# Altium schematic sheet FMC_PINBREAKOUT.SchDoc: 2.54mm Pin Header (3x 42 pos), and SMA jacks (7x)
size A4; Date: 02-NOV-2020; DrawnBy: PFH; Engineer: PFH; Organization: IAM Electronic GmbH; Revision: A; SheetNumber: 2; SheetTotal: 2; Projekt: FMC LPC Pin Header Board; Website: www.iamelectronic.com; ImagePath: FMC LPC Pinheader Board
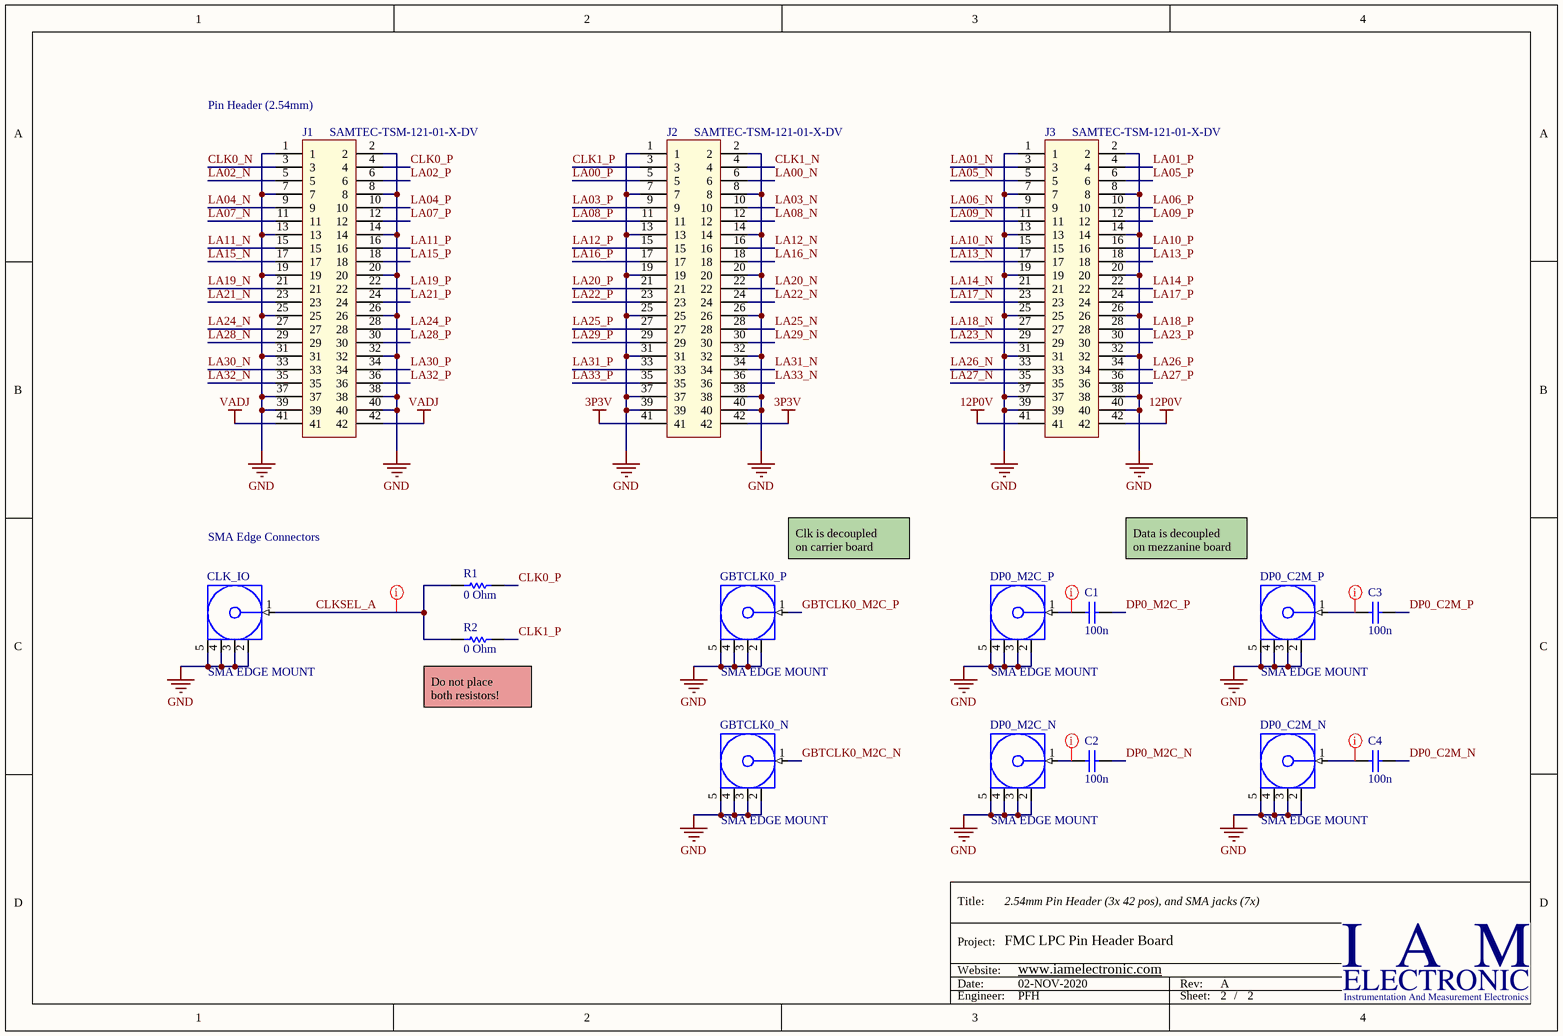
[diagram p0: FMC_PINBREAKOUT.SchDoc]

## Parts
C1  100n  [CAPC1005X55X25ML05T10]
C2  100n  [CAPC1005X55X25ML05T10]
C3  100n  [CAPC1005X55X25ML05T10]
C4  100n  [CAPC1005X55X25ML05T10]
CLK_IO  SMA EDGE MOUNT  [CON-SMA-EDGE062]
DP0_C2M_N  SMA EDGE MOUNT  [CON-SMA-EDGE062]
DP0_C2M_P  SMA EDGE MOUNT  [CON-SMA-EDGE062]
DP0_M2C_N  SMA EDGE MOUNT  [CON-SMA-EDGE062]
DP0_M2C_P  SMA EDGE MOUNT  [CON-SMA-EDGE062]
GBTCLK0_N  SMA EDGE MOUNT  [CON-SMA-EDGE062]
GBTCLK0_P  SMA EDGE MOUNT  [CON-SMA-EDGE062]
J1  SAMTEC-TSM-121-01-X-DV  [SAMTEC-TSM-121-01-X-DV]
J2  SAMTEC-TSM-121-01-X-DV  [SAMTEC-TSM-121-01-X-DV]
J3  SAMTEC-TSM-121-01-X-DV  [SAMTEC-TSM-121-01-X-DV]
R1  0 Ohm  [RESC3116X65X40LL10T20]
R2  0 Ohm  [RESC3116X65X40LL10T20]

## Nets
3P3V: J2.41 J2.42
12P0V: J3.41 J3.42
GND: CLK_IO.2(GND) CLK_IO.3(GND) CLK_IO.4(GND) CLK_IO.5(GND) DP0_C2M_N.2(GND) DP0_C2M_N.3(GND) DP0_C2M_N.4(GND) DP0_C2M_N.5(GND) DP0_C2M_P.2(GND) DP0_C2M_P.3(GND) DP0_C2M_P.4(GND) DP0_C2M_P.5(GND) DP0_M2C_N.2(GND) DP0_M2C_N.3(GND) DP0_M2C_N.4(GND) DP0_M2C_N.5(GND) DP0_M2C_P.2(GND) DP0_M2C_P.3(GND) DP0_M2C_P.4(GND) DP0_M2C_P.5(GND) GBTCLK0_N.2(GND) GBTCLK0_N.3(GND) GBTCLK0_N.4(GND) GBTCLK0_N.5(GND) GBTCLK0_P.2(GND) GBTCLK0_P.3(GND) GBTCLK0_P.4(GND) GBTCLK0_P.5(GND) J1.1 J1.2 J1.7 J1.8 J1.13 J1.14 J1.19 J1.20 J1.25 J1.26 J1.31 J1.32 J1.37 J1.38 J1.39 J1.40 J2.1 J2.2 J2.7 J2.8 J2.13 J2.14 J2.19 J2.20 J2.25 J2.26 J2.31 J2.32 J2.37 J2.38 J2.39 J2.40 J3.1 J3.2 J3.7 J3.8 J3.13 J3.14 J3.19 J3.20 J3.25 J3.26 J3.31 J3.32 J3.37 J3.38 J3.39 J3.40
VADJ: J1.41 J1.42
CLK0_N: J1.3
CLK0_P: J1.4 R1.2
CLK1_N: J2.4
CLK1_P: J2.3 R2.2
CLKSEL_A: CLK_IO.1(Signal) R1.1 R2.1
DP0_C2M_N: C4.2
DP0_C2M_P: C3.2
DP0_M2C_N: C2.2
DP0_M2C_P: C1.2
GBTCLK0_M2C_N: GBTCLK0_N.1(Signal)
GBTCLK0_M2C_P: GBTCLK0_P.1(Signal)
LA00_N: J2.6
LA00_P: J2.5
LA01_N: J3.3
LA01_P: J3.4
LA02_N: J1.5
LA02_P: J1.6
LA03_N: J2.10
LA03_P: J2.9
LA04_N: J1.9
LA04_P: J1.10
LA05_N: J3.5
LA05_P: J3.6
LA06_N: J3.9
LA06_P: J3.10
LA07_N: J1.11
LA07_P: J1.12
LA08_N: J2.12
LA08_P: J2.11
LA09_N: J3.11
LA09_P: J3.12
LA10_N: J3.15
LA10_P: J3.16
LA11_N: J1.15
LA11_P: J1.16
LA12_N: J2.16
LA12_P: J2.15
LA13_N: J3.17
LA13_P: J3.18
LA14_N: J3.21
LA14_P: J3.22
LA15_N: J1.17
LA15_P: J1.18
LA16_N: J2.18
LA16_P: J2.17
LA17_N: J3.23
LA17_P: J3.24
LA18_N: J3.27
LA18_P: J3.28
LA19_N: J1.21
LA19_P: J1.22
LA20_N: J2.22
LA20_P: J2.21
LA21_N: J1.23
LA21_P: J1.24
LA22_N: J2.24
LA22_P: J2.23
LA23_N: J3.29
LA23_P: J3.30
LA24_N: J1.27
LA24_P: J1.28
LA25_N: J2.28
LA25_P: J2.27
LA26_N: J3.33
LA26_P: J3.34
LA27_N: J3.35
LA27_P: J3.36
LA28_N: J1.29
LA28_P: J1.30
LA29_N: J2.30
LA29_P: J2.29
LA30_N: J1.33
LA30_P: J1.34
LA31_N: J2.34
LA31_P: J2.33
LA32_N: J1.35
LA32_P: J1.36
LA33_N: J2.36
LA33_P: J2.35
NetC1_1: C1.1 DP0_M2C_P.1(Signal)
NetC2_1: C2.1 DP0_M2C_N.1(Signal)
NetC3_1: C3.1 DP0_C2M_P.1(Signal)
NetC4_1: C4.1 DP0_C2M_N.1(Signal)

## Layout directives
net class S50: CLKSEL_A, NetC1_1, NetC2_1, NetC3_1, NetC4_1

## Notes on the sheet
- (near J1) Pin Header (2.54mm)
- SMA Edge Connectors
- Clk is decoupled
  on carrier board
- Data is decoupled
  on mezzanine board
- (near R2) Do not place
  both resistors!
- Title:
- Project:
- Date:
- Website:
- Rev:
- Engineer:
- Sheet:
- /

## Library data of the parts
C1-C4 = CMP-2100-03641-1: Chip Capacitor, 0.1 uF, +/- 10%, 16 V, -55 to 125 degC, 0402 (1005 Metric), RoHS, Tape and Reel; Manufacturer: Murata; Part: GRM155R71C104KA88D; Material: Ceramic; Insulation Resistance: 10GR; Voltage: 16V; Dielectric: X7R; Capacitance: 100nF; REACH SVHC: NoSVHC; Depth: 0.5mm; Case/Package: 0402; Datasheet URL: http://psearch.en.murata.com/capacitor/product/GRM155R71C104KA88%23.pdf; Lead Free: LeadFree; Dielectric Material: Ceramic; Manufacturer URL: http://www.murata.com/; Min Operating Temperature: -55degC; Length: 1mm; Case Code (Metric): 1005; Radiation Hardening: No; Package Reference: 0402; RoHSCompliant: true; Datasheet Version: 42675.0; Thickness: 0.022inch; Packaging: TapeandReel; Voltage Rating (DC): 16V; Tolerance: 10%; Max Operating Temperature: 125degC; Package Description: 2-Pin Surface Mount Device, Body 1 x 0.5 mm; Mount: SurfaceMount; Height: 0.5mm; Width: 0.5mm; Number of Pins: 2; Voltage Rating: 16V; Case Code (Imperial): 0402; Termination: SMD/SMT; Package Quantity: 1
CLK_IO DP0_C2M_N DP0_C2M_P DP0_M2C_N DP0_M2C_P GBTCLK0_N GBTCLK0_P = CMP-0168-00046-1: RP-SMA Female Edge Mount Connector for 0.062" Thick Board; Manufacturer: Samtec; Part: SMA-J-P-H-ST-EM1; PCB_Layout: Pads complies with manufacturer's recommendation.; DatasheetVersion: rev1.0, Jun-2006; PackageVersion: rev1.0, Jun-2006; PackageReference: CON-SMA-EDGE062; PackageDescription: SMA Female Edge Mount for Connector 0.062" Thick Board, Reverse-polarity, 7.9 mm Body Dia.
J1-J3 = SAMTEC-TSM-121-01-X-DV: SMT 2.54mm SQ POST HEADER; Manufacturer: Samtec; Part: TSM-121-01-T-DV; Plating Option: T-Matte Tin; Rows: 2; Pins per row: 21; Post Height: 5.84mm; PARTNO: TSM-121-01-T-DV
R1 R2 = CMP-2100-03681-1: Chip Resistor, 0 Ohm, +/- 5%, -55 to 155 degC, 1206 (3216 Metric), RoHS, Tape and Reel; Manufacturer: Yageo; Part: RC1206JR-070RL; Max Power Dissipation: 250mW; Resistance: 0mOhm; Voltage Rating: 200V; Temperature Coefficient: 200ppm/degreesC; Case Code (Imperial): 1206; Lead Free: LeadFree; Package Quantity: 5000; Radiation Hardening: No; Tolerance: 5%; Length: 3.1mm; Termination: SMD/SMT; Contact Plating: Tin; Military Standard: Not; Manufacturer URL: http://www.yageo.com/; Datasheet URL: http://www.yageo.com/documents/recent/PYu-RC_Group_51_RoHS_L_5.pdf; Height: 0.026inch; RoHSCompliant: true; Min Operating Temperature: -55degC; REACH SVHC: Unknown; Max Operating Temperature: 155degC; Depth: 1.6mm; Packaging: TapeandReel; Package Reference: 1206.0; Number of Terminations: 2; Case/Package: 1206; Composition: CarbonFilm; Case Code (Metric): 3216; Datasheet Version: Rev. 5, 10/2016; Power Rating: 250mW; Package Description: 2-Pin Surface Mount Device, Body 3.1 x 1.6 mm; Width: 0.063inch